# Altium schematic sheet uController.SchDoc
size A4
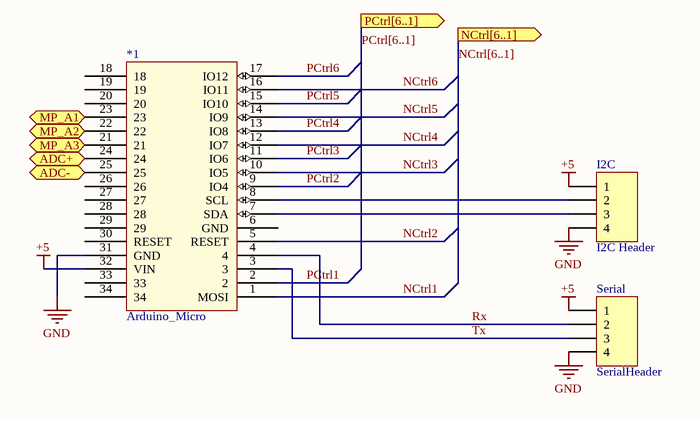
[diagram p0: uController.SchDoc]

## Parts
*1  Arduino_Micro  [DIP34]
I2C  I2C Header  [HDR1X4]
Serial  SerialHeader  [HDR1X4]

## Ports
ADC+ (in), ADC- (in), MP_A1 (out), MP_A2 (out), MP_A3 (out), NCtrl[6..1] (out), PCtrl[6..1] (out)

## Nets
+5: *1.32(VIN) I2C.1 Serial.1
GND: *1.31(GND) I2C.4 Serial.4
ADC+: *1.24 ; port ADC+
ADC-: *1.25 ; port ADC-
MP_A1: *1.23 ; port MP_A1
MP_A2: *1.22 ; port MP_A2
MP_A3: *1.21 ; port MP_A3
NCtrl1: *1.1(MOSI)
NCtrl2: *1.5(RESET)
NCtrl3: *1.10(IO5)
NCtrl4: *1.12(IO7)
NCtrl5: *1.14(IO9)
NCtrl6: *1.16(IO11)
PCtrl1: *1.2
PCtrl2: *1.9(IO4)
PCtrl3: *1.11(IO6)
PCtrl4: *1.13(IO8)
PCtrl5: *1.15(IO10)
PCtrl6: *1.17(IO12)
Rx: *1.4 Serial.2
Tx: *1.3 Serial.3
Net*1_7: *1.7(SDA) I2C.3
Net*1_8: *1.8(SCL) I2C.2

Not connected (* = marked no-connect by the designer): *1 6(GND) 18 19 20 26 27 28 29 30(RESET) 33 34

## Buses and harness runs
bus NCtrl[6..1] = port NCtrl[6..1]
bus PCtrl[6..1] = port PCtrl[6..1]

## Library data of the parts
I2C Serial = Header 4: Header, 4-Pin; LatestRevisionDate: 17-Jul-2002; LatestRevisionNote: Re-released for DXP Platform.; Publisher: Altium Limited